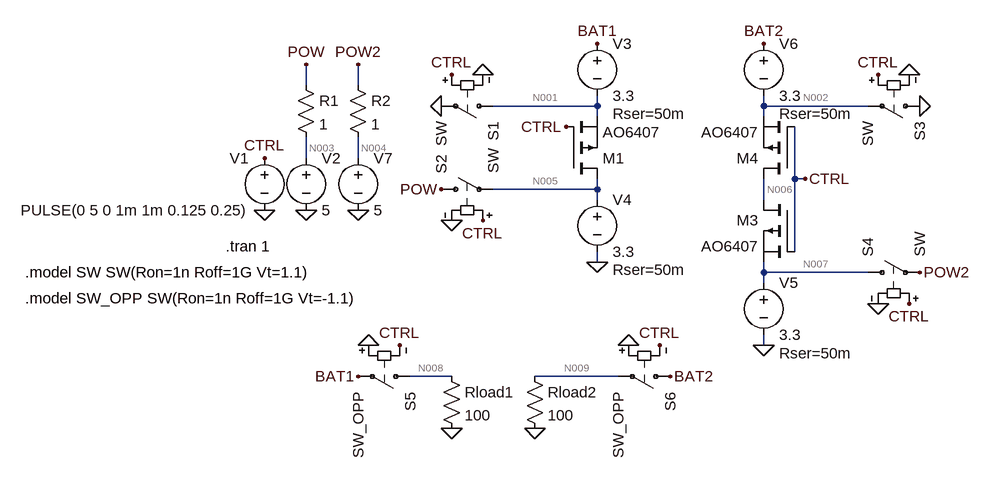
[diagram p0: schematic SingleFET_v_BacktoBackFET_switches.asc]
SingleFET_v_BacktoBackFET_switches.asc, the LTspice schematic file:
Version 4
SHEET 1 880 800
WIRE -736 208 -736 176
WIRE -656 208 -656 176
WIRE -288 240 -288 224
WIRE -288 240 -448 240
WIRE -32 240 -32 224
WIRE 128 240 -32 240
WIRE -288 256 -288 240
WIRE -32 256 -32 240
WIRE -736 320 -736 288
WIRE -656 320 -656 288
WIRE 16 352 16 272
WIRE 32 352 16 352
WIRE -288 368 -288 352
WIRE -288 368 -448 368
WIRE -288 384 -288 368
WIRE -32 384 -32 352
WIRE 16 464 16 352
WIRE -288 480 -288 464
WIRE -32 496 -32 480
WIRE 128 496 -32 496
WIRE -32 512 -32 496
WIRE -32 608 -32 592
WIRE -512 656 -576 656
WIRE -256 656 -384 656
FLAG 32 352 CTRL
FLAG -800 320 CTRL
FLAG -736 176 POW
FLAG -800 400 0
FLAG -736 400 0
FLAG -336 272 CTRL
FLAG -656 176 POW2
FLAG -656 400 0
FLAG -288 480 0
FLAG -32 608 0
FLAG -288 144 BAT1
FLAG -32 144 BAT2
FLAG -528 240 0
FLAG 208 240 0
FLAG -528 368 POW
FLAG 208 496 POW2
FLAG -464 192 0
FLAG -512 416 0
FLAG 144 544 0
FLAG 192 192 0
FLAG -464 416 CTRL
FLAG -512 192 CTRL
FLAG 144 192 CTRL
FLAG 192 544 CTRL
FLAG -512 736 0
FLAG -384 736 0
FLAG -640 608 0
FLAG -240 608 0
FLAG -592 608 CTRL
FLAG -192 608 CTRL
FLAG -656 656 BAT1
FLAG -176 656 BAT2
SYMBOL pmos 16 384 M0
SYMATTR InstName M3
SYMATTR Value AO6407
SYMBOL pmos 16 352 R180
SYMATTR InstName M4
SYMATTR Value AO6407
SYMBOL voltage -800 304 M0
WINDOW 123 0 0 Left 2
WINDOW 39 0 0 Left 2
SYMATTR InstName V1
SYMATTR Value PULSE(0 5 0 1m 1m 0.125 0.25)
SYMBOL voltage -736 304 R0
SYMATTR InstName V2
SYMATTR Value 5
SYMBOL pmos -336 352 M180
SYMATTR InstName M1
SYMATTR Value AO6407
SYMBOL voltage -288 128 R0
WINDOW 123 0 0 Left 2
WINDOW 39 24 124 Left 2
SYMATTR InstName V3
SYMATTR Value 3.3
SYMATTR SpiceLine Rser=50m
SYMBOL voltage -288 368 R0
WINDOW 123 0 0 Left 2
WINDOW 39 24 124 Left 2
SYMATTR InstName V4
SYMATTR Value 3.3
SYMATTR SpiceLine Rser=50m
SYMBOL voltage -32 496 R0
WINDOW 123 0 0 Left 2
WINDOW 39 24 124 Left 2
SYMATTR InstName V5
SYMATTR Value 3.3
SYMATTR SpiceLine Rser=50m
SYMBOL voltage -32 128 R0
WINDOW 123 0 0 Left 2
WINDOW 39 24 124 Left 2
SYMATTR InstName V6
SYMATTR Value 3.3
SYMATTR SpiceLine Rser=50m
SYMBOL voltage -656 304 R0
SYMATTR InstName V7
SYMATTR Value 5
SYMBOL sw -432 240 R90
SYMATTR InstName S1
SYMBOL sw -544 368 R270
SYMATTR InstName S2
SYMBOL sw 224 240 R90
SYMATTR InstName S3
SYMBOL sw 112 496 R270
SYMATTR InstName S4
SYMBOL res -752 192 R0
SYMATTR InstName R1
SYMATTR Value 1
SYMBOL res -672 192 R0
SYMATTR InstName R2
SYMATTR Value 1
SYMBOL res -528 640 R0
SYMATTR InstName Rload1
SYMATTR Value 100
SYMBOL res -400 640 R0
SYMATTR InstName Rload2
SYMATTR Value 100
SYMBOL sw -560 656 R90
SYMATTR InstName S5
SYMATTR Value SW_OPP
SYMBOL sw -160 656 R90
SYMATTR InstName S6
SYMATTR Value SW_OPP
TEXT -860 456 Left 2 !.tran 1
TEXT -1168 496 Left 2 !.model SW SW(Ron=1n Roff=1G Vt=1.1)
TEXT -1168 536 Left 2 !.model SW_OPP SW(Ron=1n Roff=1G Vt=-1.1)

The netlist it stands for:
* SingleFET_v_BacktoBackFET_switches.asc
M3 N006 CTRL N007 N007 AO6407
M4 N006 CTRL N002 N002 AO6407
V1 CTRL 0 PULSE(0 5 0 1m 1m 0.125 0.25)
V2 N003 0 5
M1 N005 CTRL N001 N001 AO6407
V3 BAT1 N001 3.3 Rser=50m
V4 N005 0 3.3 Rser=50m
V5 N007 0 3.3 Rser=50m
V6 BAT2 N002 3.3 Rser=50m
V7 N004 0 5
S1 N001 0 CTRL 0 SW
S2 POW N005 CTRL 0 SW
S3 0 N002 CTRL 0 SW
S4 N007 POW2 CTRL 0 SW
R1 POW N003 1
R2 POW2 N004 1
Rload1 N008 0 100
Rload2 N009 0 100
S5 N008 BAT1 0 CTRL SW_OPP
S6 BAT2 N009 0 CTRL SW_OPP
.model NMOS NMOS
.model PMOS PMOS
.lib standard.mos
.tran 1
.model SW SW(Ron=1n Roff=1G Vt=1.1)
.model SW_OPP SW(Ron=1n Roff=1G Vt=-1.1)
.backanno
.end

* Results of the author's LTspice run, read from the files saved beside the schematic
* Operating Point, zero values left out:
*   V(n006) = 3.294 V
*   V(n007) = 3.297 V
*   V(n002) = 3.292 V
*   V(n003) = 5 V
*   V(n005) = 3.297 V
*   V(n001) = 3.294 V
*   V(bat1) = 6.591 V
*   V(bat2) = 6.589 V
*   V(n004) = 5 V
*   V(pow) = 5 V
*   V(pow2) = 5 V
*   V(n008) = 6.591 V
*   V(n009) = 6.589 V
*   Id(M1) = 65.91 mA
*   Is(M1) = -65.91 mA
*   Id(M4) = 65.89 mA
*   Is(M4) = -65.89 mA
*   Id(M3) = -65.89 mA
*   Is(M3) = 65.89 mA
*   I(Rload2) = 65.89 mA
*   I(Rload1) = 65.91 mA
*   I(R2) = -1.705 nA
*   I(R1) = -1.705 nA
*   I(S6) = -65.89 mA
*   I(S5) = 65.91 mA
*   I(S4) = 1.705 nA
*   I(S3) = 3.295 nA
*   I(S2) = -1.705 nA
*   I(S1) = -3.298 nA
*   I(V7) = -1.705 nA
*   I(V6) = -65.89 mA
*   I(V5) = -65.89 mA
*   I(V4) = -65.91 mA
*   I(V3) = -65.91 mA
*   I(V2) = -1.705 nA
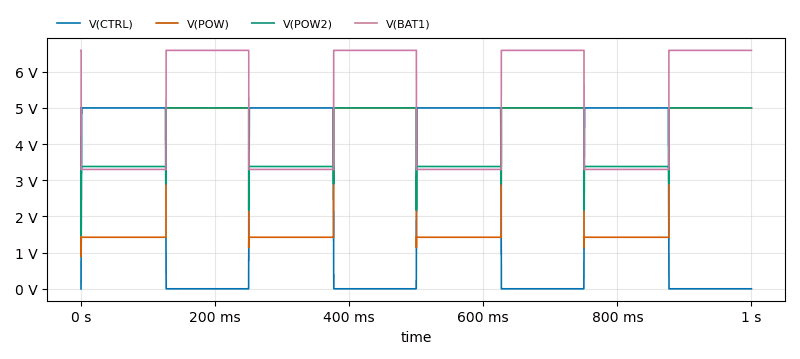
[diagram p1: Transient Analysis of SingleFET_v_BacktoBackFET_switches.asc, plotted from the saved traces]
* Transient Analysis, 1 run:
*   V(CTRL): min 0 V, max 5 V, average 2.52 V, rms 3.545 V, last 0 V
*   V(POW): min 893.6 mV, max 5 V, average 3.19 V, rms 3.657 V, last 5 V
*   V(POW2): min 1.473 V, max 5 V, average 4.18 V, rms 4.258 V, last 5 V
*   V(BAT1): min 3.3 V, max 6.591 V, average 4.925 V, rms 5.193 V, last 6.591 V